# Altium project RFID_CC1101_869MHz.PrjPcb
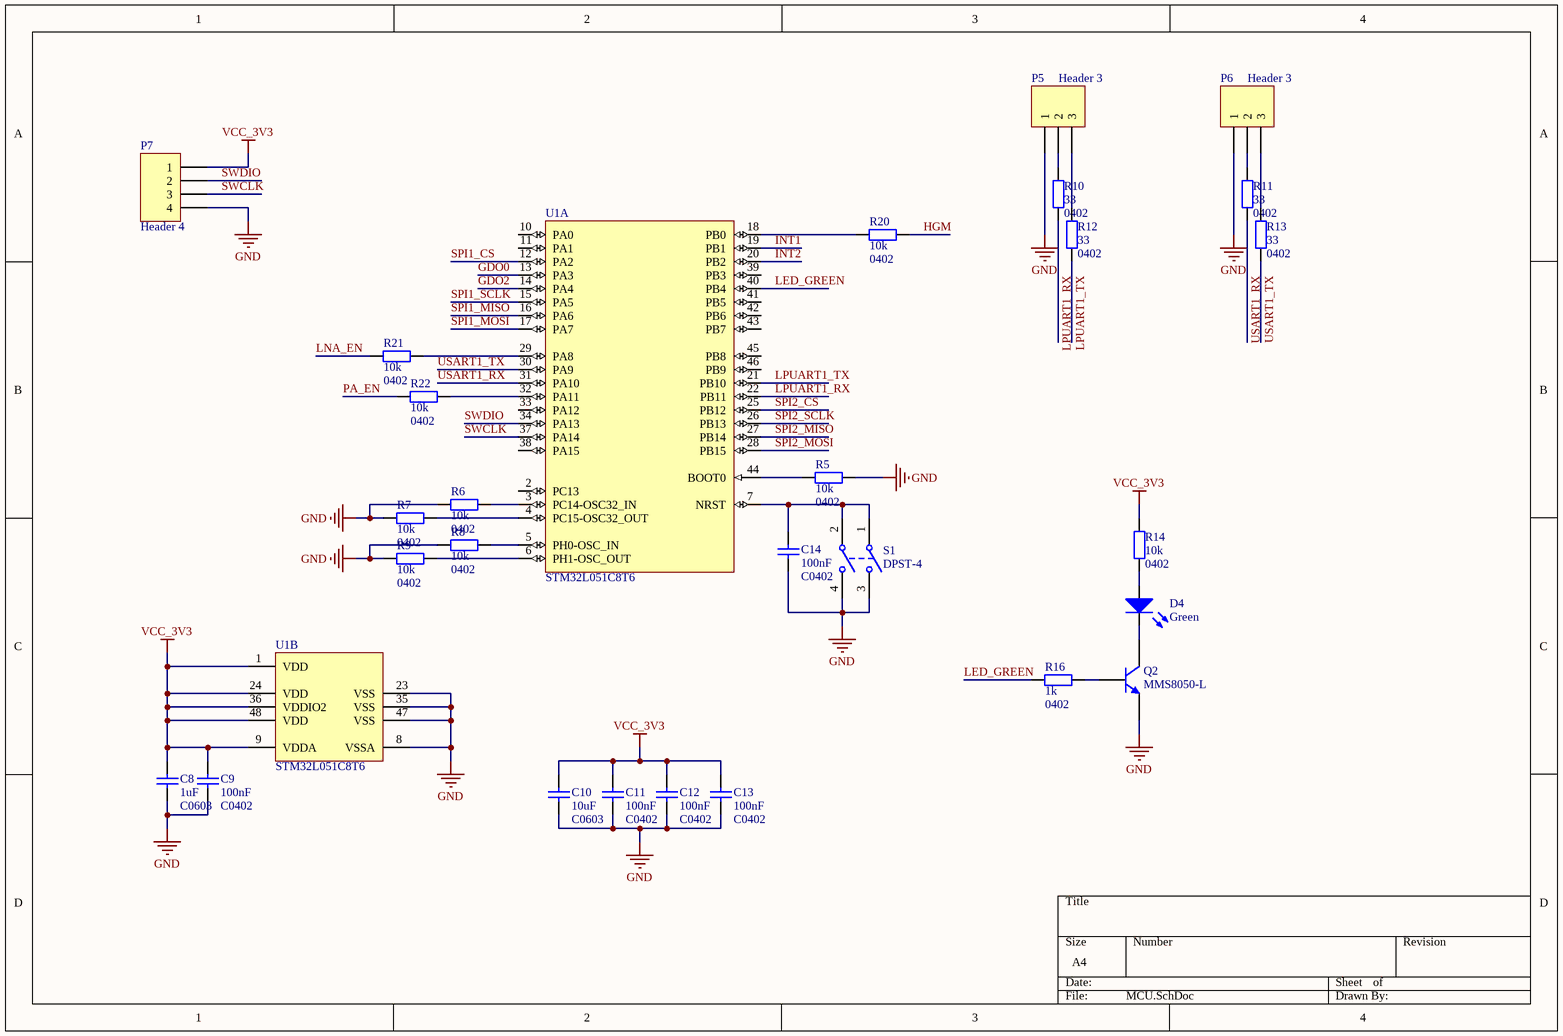
[diagram p0: MCU.SchDoc]
3 sheets, 110 parts. Net scope: global (net labels, ports and power ports of the same name join across sheets).
Board file: RFID_CC1101_869MHz.PcbDoc
Sheets:
  MCU.SchDoc
  Power.SchDoc
  MEMS&RF.SchDoc

## Sheet MCU.SchDoc
size A4

### Parts
C8  1uF  PackageReference: C0603  [1608[0603]]
C9  100nF  PackageReference: C0402  [0402]
C10  10uF  PackageReference: C0603  [1608[0603]]
C11  100nF  PackageReference: C0402  [0402]
C12  100nF  PackageReference: C0402  [0402]
C13  100nF  PackageReference: C0402  [0402]
C14  100nF  PackageReference: C0402  [0402]
D4  Green  [0603/K]
P5  Header 3  [HDR1X3]
P6  Header 3  [HDR1X3]
P7  Header 4  [HDR1x4-2MM]
Q2  MMS8050-L  [SOT-23B_N]
R5  10k  PackageReference: 0402  [RESC1005X04N]
R6  10k  PackageReference: 0402  [RESC1005X04N]
R7  10k  PackageReference: 0402  [RESC1005X04N]
R8  10k  PackageReference: 0402  [RESC1005X04N]
R9  10k  PackageReference: 0402  [RESC1005X04N]
R10  33  PackageReference: 0402  [RESC1005X04N]
R11  33  PackageReference: 0402  [RESC1005X04N]
R12  33  PackageReference: 0402  [RESC1005X04N]
R13  33  PackageReference: 0402  [RESC1005X04N]
R14  10k  PackageReference: 0402  [RESC1005X04N]
R16  1k  PackageReference: 0402  [RESC1005X04N]
R20  10k  PackageReference: 0402  [RESC1005X04N]
R21  10k  PackageReference: 0402  [RESC1005X04N]
R22  10k  PackageReference: 0402  [RESC1005X04N]
S1  DPST-4  [DPST]
U1  STM32L051C8T6  [STM-LQFP48_N]  (parts A,B of 2)

### Nets
GND: C8.1 C9.1 C10.1 C11.2 C12.2 C13.2 C14.2 P5.1 P6.1 P7.4 Q2.E R5.2 R6.1 R7.1 R8.1 R9.1 S1.3(NO1) S1.4(NO2) U1.8(VSSA) U1.23(VSS) U1.35(VSS) U1.47(VSS)
VCC_3V3: C8.2 C9.2 C10.2 C11.1 C12.1 C13.1 P7.1 R14.2 U1.1(VDD) U1.9(VDDA) U1.24(VDD) U1.36(VDDIO2) U1.48(VDD)
GDO0: U1.13(PA3)
GDO2: U1.14(PA4)
HGM: R20.2
INT1: U1.19(PB1)
INT2: U1.20(PB2)
LED_GREEN: R16.1 U1.40(PB4)
LNA_EN: R21.1
LPUART1_RX: R10.1 U1.22(PB11)
LPUART1_TX: R12.2 U1.21(PB10)
PA_EN: R22.1
SPI1_CS: U1.12(PA2)
SPI1_MISO: U1.16(PA6)
SPI1_MOSI: U1.17(PA7)
SPI1_SCLK: U1.15(PA5)
SPI2_CS: U1.25(PB12)
SPI2_MISO: U1.27(PB14)
SPI2_MOSI: U1.28(PB15)
SPI2_SCLK: U1.26(PB13)
SWCLK: P7.3 U1.37(PA14)
SWDIO: P7.2 U1.34(PA13)
USART1_RX: R11.1 U1.31(PA10)
USART1_TX: R13.2 U1.30(PA9)
NetC14_1: C14.1 S1.1(COMMON1) S1.2(COMMON2) U1.7(NRST)
NetD4_A: D4.A R14.1
NetD4_K: D4.K Q2.C
NetP5_2: P5.2 R10.2
NetP5_3: P5.3 R12.1
NetP6_2: P6.2 R11.2
NetP6_3: P6.3 R13.1
NetQ2_B: Q2.B R16.2
NetR5_1: R5.1 U1.44(BOOT0)
NetR6_2: R6.2 U1.3(PC14-OSC32_IN)
NetR7_2: R7.2 U1.4(PC15-OSC32_OUT)
NetR8_2: R8.2 U1.5(PH0-OSC_IN)
NetR9_2: R9.2 U1.6(PH1-OSC_OUT)
NetR20_1: R20.1 U1.18(PB0)
NetR21_2: R21.2 U1.29(PA8)
NetR22_2: R22.2 U1.32(PA11)

Not connected (* = marked no-connect by the designer): U1 2(PC13) 10(PA0) 11(PA1) 33(PA12) 38(PA15) 39(PB3) 41(PB5) 42(PB6) 43(PB7) 45(PB8) 46(PB9)

### Library data of the parts
C8 = CGA3E2X5R1A105K080AA: Capacitor (0603,X5R,1uF,DC 10V,+/-10%) TDK; Published: 8-Jun-2000; LatestRevisionDate: 29-May-2009; LatestRevisionNote: IPC-7351 Footprint Added.; Publisher: Altium Limited; PackageDescription: Chip Capacitor; Value: 1uF
C9 C11-C14 = CGA2B2X5R1A104K050BA: Capacitor (0402,X5R,100nF,DC 10V,±10%) TDK; Published: 8-Jun-2000; LatestRevisionDate: 29-May-2009; LatestRevisionNote: IPC-7351 Footprint Added.; Publisher: Altium Limited; PackageDescription: Chip Capacitor; Value: 100nF
C10 = C1608X5R1A106K080AC: Capacitor (0603,X5R,10uF,DC 10V,±10%) TDK; Published: 8-Jun-2000; LatestRevisionDate: 29-May-2009; LatestRevisionNote: IPC-7351 Footprint Added.; Publisher: Altium Limited; PackageDescription: Chip Capacitor; Value: 10uF
D4 = TLMG1100-GS08: Standard 0603 SMD LED, Green, 2.1V,-40 °C to +100 °C; Published: 8-Jun-2000; LatestRevisionDate: 17-Jul-2002; LatestRevisionNote: Re-released for DXP Platform.; PackageVersion: Feb-2002; PackageReference: 0603; Publisher: Altium Limited; PackageDescription: SM LED; 2 Flat Leads; Valid: Green
P5 P6 = Header 3: Header, 3-Pin; LatestRevisionDate: 17-Jul-2002; LatestRevisionNote: Re-released for DXP Platform.; Publisher: Altium Limited
P7 = Header 4: Header, 4-Pin; LatestRevisionDate: 17-Jul-2002; LatestRevisionNote: Re-released for DXP Platform.; Publisher: Altium Limited
Q2 = MMS8050-L: NPN Silicon  Plastic-Encapsulate  Transistor , MCC , Range:120-200; Published: 8-Jun-2000; LatestRevisionDate: 17-Jul-2002; LatestRevisionNote: Re-released for DXP Platform.; PackageReference: TO-226-AA; Publisher: Altium Limited; PackageDescription: TO, Flat Index; 3 In-Line, Axial Leads; Body Dia. 4.8mm; Leads 0.55 x 0.51 mm (max); Code_JEDEC: TO-226-AA
R5-R9 R14 R20-R22 = RC0402FR-0710KL: Resistor 0402(1005) 10kΩ ±1%; PackageDescription: Chip Resistor, 2-Leads, Body 1.00x0.50mm, IPC Medium Density; Value: 10k
R10-R13 = RC0402FR-0733RL: Resistor 0402(1005) 33Ω ±1%; PackageDescription: Chip Resistor, 2-Leads, Body 1.00x0.50mm, IPC Medium Density; Value: 33
R16 = RC0402FR-071KL: Resistor 0402(1005) 1kΩ ±1%; PackageDescription: Chip Resistor, 2-Leads, Body 1.00x0.50mm, IPC Medium Density; Value: 1k
S1 = CX-G001: 5.2*5.2轻触开关; Published: 24-Mar-1999; LatestRevisionDate: 17-Jul-2002; LatestRevisionNote: Re-released for DXP Platform.; PackageReference: DPST-4; Publisher: Altium Limited; PackageDescription: Switch; 4 Leads
U1 = STM32L051C8T6: Access line ultra-low-power 32-bit MCU Arm®-based Cortex®-M0+, 64 KB Flash, 8 KB SRAM,2 KB EEPROM, 38 fast I/Os, 48-pin LQFP, -40 to 125 degC, Tray; A/D Converter: 2x12-bit; Core: ARM Cortex-M0+; FLASH Size (Prog) (kB): 64; I/Os (High Current): 37; Internal RAM Size (kB): 20; Operating Frequency(F) (Processor speed) (MHz): 32; Supply Voltage(Vcc) min (V): 2; DatasheetVersion: Rev. 16; PackageVersion: Rev. 6, 06/2013; PackageReference: LQFP48; PackageDescription: 48-Pin Low Profile Quad Flat Package, 7 x 7 mm Body, 0.5 mm Pitch; Supplier 1: Digi-Key; Supplier Part Number 1: 497-11517-ND; Supplier 2: Farnell; Supplier Part Number 2: 1899017; Supplier 3: Newark; Supplier Part Number 3: 72T2644; Supplier 4: Mouser; Supplier Part Number 4: 511-STM32L051C8T6; Packing: Tray; Mounting Technology: Surface Mount; PartNumber: STM32L051C8T6; ComponentLink1Description: Manufacturer URL; ComponentLink1URL: http://www.st.com/web/en/home.html; ComponentLink2Description: Datasheet; ComponentLink2URL: http://www.st.com/st-web-ui/static/active/en/resource/technical/document/datasheet/CD00161566.pdf; ComponentLink3Description: Package Specification; ComponentLink3URL: http://www.st.com/st-web-ui/static/active/en/resource/technical/document/datasheet/DM00058181.pdf

## Sheet Power.SchDoc
size A4
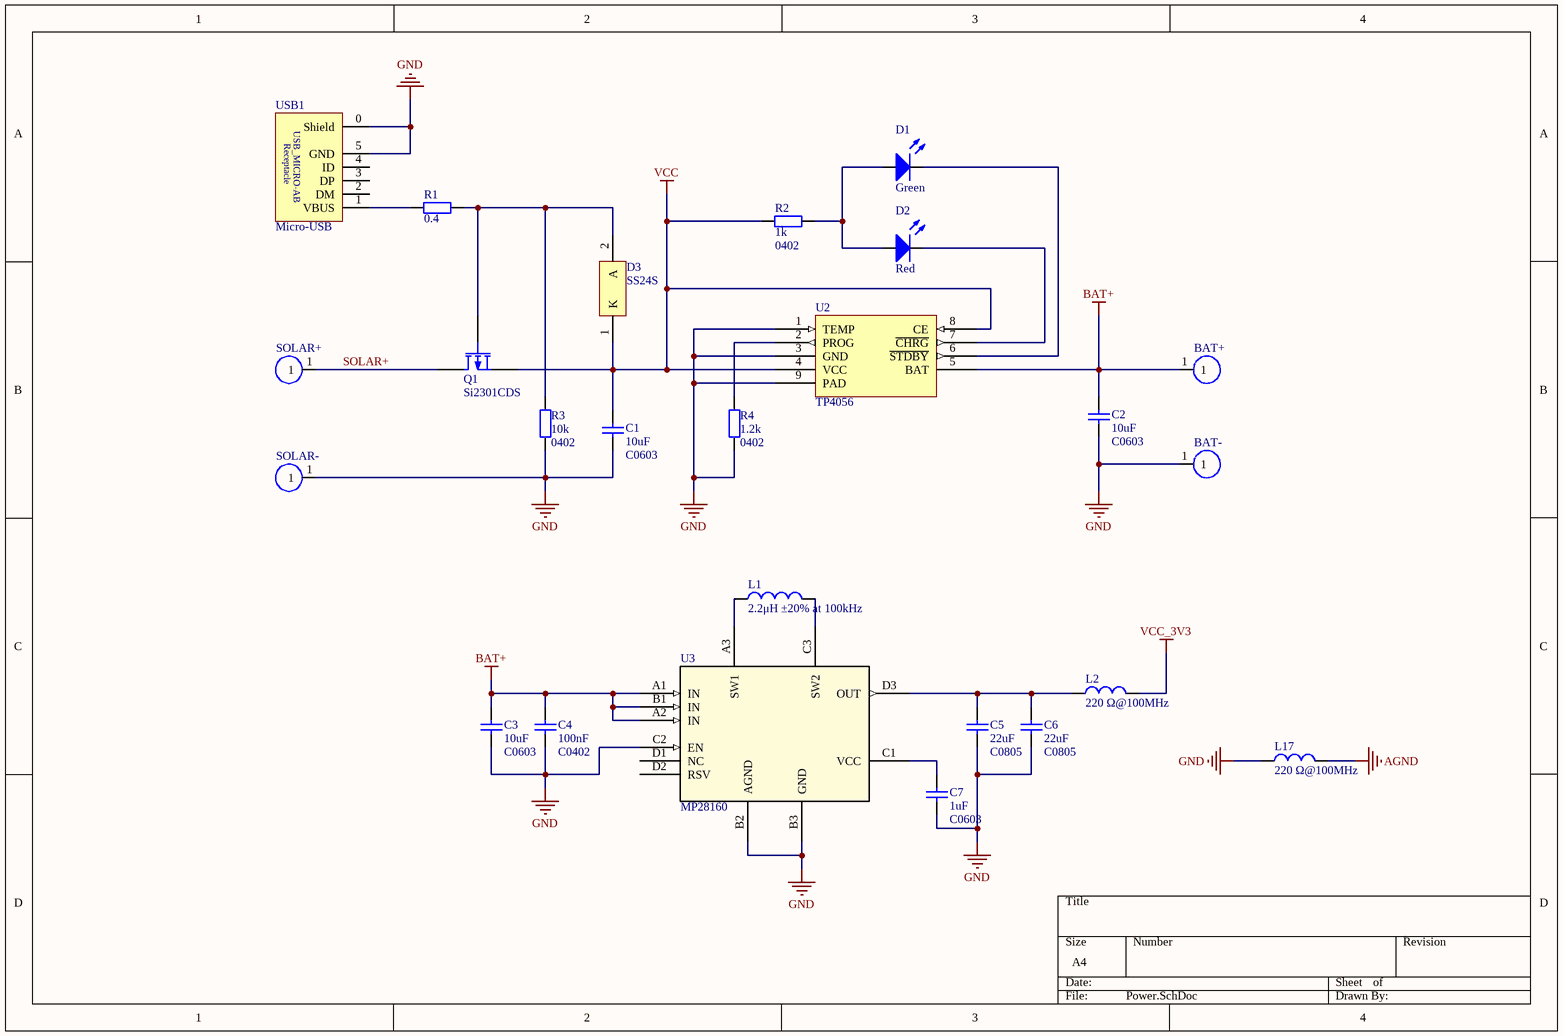
[diagram p1: Power.SchDoc]

### Parts
BAT+  BAT+  [surface_pad]  (value not drawn)
BAT-  BAT-  [surface_pad]  (value not drawn)
C1  10uF  PackageReference: C0603  [1608[0603]]
C2  10uF  PackageReference: C0603  [1608[0603]]
C3  10uF  PackageReference: C0603  [1608[0603]]
C4  100nF  PackageReference: C0402  [0402]
C5  22uF  [C0805]
C6  22uF  [C0805]
C7  1uF  PackageReference: C0603  [1608[0603]]
D1  Green  [0603/K]
D2  Red  [0603/K]
D3  SS24S  [ONSC-SMA-2-403D-02_V]
L1  2.2μH ±20% at 100kHz  [INDP3230X10N]
L2  220 Ω@100MHz  [RESC2012X07N]
L17  220 Ω@100MHz  [RESC2012X07N]
Q1  Si2301CDS  [SOT95P237X112-3N]
R1  0.4  [RESC3216X07N]
R2  1k  PackageReference: 0402  [RESC1005X04N]
R3  10k  PackageReference: 0402  [RESC1005X04N]
R4  1.2k  PackageReference: 0402  [RESC1005X04N]
SOLAR+  SOLAR+  [surface_pad]  (value not drawn)
SOLAR-  SOLAR-  [surface_pad]  (value not drawn)
U2  TP4056  [ESOP-9N]
U3  MP28160  [CSP-12]
USB1  Micro-USB  [USB_Micro_5P4J]

### Nets
AGND: L17.2
BAT+: BAT+.1 C2.2 C3.2 C4.2 U2.5(BAT) U3.A1(IN) U3.A2(IN) U3.B1(IN)
GND: BAT-.1 C1.1 C2.1 C3.1 C4.1 C5.1 C6.1 C7.1 L17.1 R3.1 R4.1 SOLAR-.1 U2.1(TEMP) U2.3(GND) U2.9(PAD) U3.B2(AGND) U3.B3(GND) U3.C2(EN) USB1.0(Shield) USB1.5(GND)
VCC: C1.2 D3.1(K) Q1.2(S) R2.1 U2.4(VCC) U2.8(CE)
VCC_3V3: L2.2
SOLAR+: Q1.3(D) SOLAR+.1
NetC5_2: C5.2 C6.2 L2.1 U3.D3(OUT)
NetC7_2: C7.2 U3.C1(VCC)
NetD1_A: D1.A D2.A R2.2
NetD1_K: D1.K U2.6(~{STDBY})
NetD2_K: D2.K U2.7(~{CHRG})
NetD3_2: D3.2(A) Q1.1(G) R1.2 R3.2
NetL1_1: L1.1 U3.A3(SW1)
NetL1_2: L1.2 U3.C3(SW2)
NetR1_1: R1.1 USB1.1(VBUS)
NetR4_2: R4.2 U2.2(PROG)

Not connected (* = marked no-connect by the designer): U3 D1(NC) D2(RSV); USB1 2(DM) 3(DP) 4(ID)

### Notes on the sheet
- (in symbol USB/Micro-AB) USB_MICRO-AB; Receptacle

### Library data of the parts
BAT+ BAT- SOLAR+ SOLAR- = SURFACE_PAD: PAD
C1-C3 = C1608X5R1A106K080AC: as C10 on sheet MCU; Published: 8-Jun-2000; LatestRevisionDate: 29-May-2009; LatestRevisionNote: IPC-7351 Footprint Added.; Publisher: Altium Limited; PackageDescription: Chip Capacitor; Value: 10uF
C4 = CGA2B2X5R1A104K050BA: as C9 on sheet MCU; Published: 8-Jun-2000; LatestRevisionDate: 29-May-2009; LatestRevisionNote: IPC-7351 Footprint Added.; Publisher: Altium Limited; PackageDescription: Chip Capacitor; Value: 100nF
C5 C6 = C2012X5R1A226K125AB: Capacitor (0805,X5R,22uF,DC 10V,±10%) TDK; Published: 8-Jun-2000; LatestRevisionDate: 29-May-2009; LatestRevisionNote: IPC-7351 Footprint Added.; Publisher: Altium Limited; PackageDescription: Chip Capacitor; Value: 22uF; PackageReference: C0805
C7 = CGA3E2X5R1A105K080AA: as C8 on sheet MCU; Published: 8-Jun-2000; LatestRevisionDate: 29-May-2009; LatestRevisionNote: IPC-7351 Footprint Added.; Publisher: Altium Limited; PackageDescription: Chip Capacitor; Value: 1uF
D1 = TLMG1100-GS08: as D4 on sheet MCU; Published: 8-Jun-2000; LatestRevisionDate: 17-Jul-2002; LatestRevisionNote: Re-released for DXP Platform.; PackageVersion: Feb-2002; PackageReference: 0603; Publisher: Altium Limited; PackageDescription: SM LED; 2 Flat Leads; Valid: Green
D2 = TLMS1100-GS08: Standard 0603 SMD LED, Red, 2.1V,-40 °C to +100 °C; Published: 8-Jun-2000; LatestRevisionDate: 17-Jul-2002; LatestRevisionNote: Re-released for DXP Platform.; PackageVersion: Feb-2002; PackageReference: 0603; Publisher: Altium Limited; PackageDescription: SM LED; 2 Flat Leads; Valid: Red
D3 = SS24S: Schottky Power Rectifier, 2-Pin SMA, VRRM=40V , VF=0.517V at IF=2.0A , Pb-Free, Tape and Reel; Manufacturer: On Semiconductor; Configuration: Single; IFSM Max (A): 40; DatasheetVersion: Rev. 7; PackageVersion: Rev. G, 07/2012; PackageReference: SMA-2-403D-02; PackageDescription: 2-Pin Small Molded Package, J-Bend Lead, Body 2.605 x 4.315 mm; Supplier 1: Digi-Key; Supplier Part Number 1: SS16T3GOSTR-ND; Supplier 2: Digi-Key; Supplier Part Number 2: SS16T3GOSCT-ND; Supplier 3: Digi-Key; Supplier Part Number 3: SS16T3GOSDKR-ND; Supplier 4: Farnell; Supplier Part Number 4: 2317421; Supplier 5: Farnell; Supplier Part Number 5: 1900107; Supplier 6: Newark; Supplier Part Number 6: 98H0976; Supplier 7: Newark; Supplier Part Number 7: 10N9613; Supplier 8: Mouser; Supplier Part Number 8: 863-SS16T3G; Packing: Tape and Reel; RoHS: TRUE; Mounting Technology: Surface Mount; PartNumber: SS24S; ComponentLink1Description: Manufacturer URL; ComponentLink1URL: http://www.onsemi.com/; ComponentLink2Description: Datasheet; ComponentLink2URL: http://www.onsemi.cn/pub_link/Collateral/SS16-D.PDF; ComponentLink3Description: Package Specification; ComponentLink3URL: http://www.onsemi.com/pub_link/Collateral/403D-02.PDF
L1 = SPM3010T-2R2M-LR: inductor_commercial_power, 2.2μH ±20% at 100kHz, 2.6A, 3.2mm*3.0mm, -40～125°C; PackageReference: 3230; PackageDescription: inductor, 2-Leads, Body 2.00x1.25mm, IPC Medium Density; Value: 2.2μH ±20% at 100kHz
L2 L17 = FBMH2012HM221-T: 220Ω, 2 A, 0805/2012 (EIA/JIS); PackageReference: 0805; PackageDescription: Bead Inductor, 2-Leads, Body 2.00x1.25mm, IPC Medium Density; Value: 220 Ω@100MHz
Q1 = Si2301CDS: P-Channel MOSFET,VDS=-20V,VGS=8V,ID=3.1A,VGS(th)Min=0.4V,SOT-23; Published: 8-Jun-2000; LatestRevisionDate: 17-Jul-2002; LatestRevisionNote: Re-released for DXP Platform.; PackageVersion: 1995/1996; PackageReference: SOT23; Publisher: Altium Limited; PackageDescription: SOT23, 3-Leads, Body 2.92x2.37mm, Pitch 0.95mm, IPC Medium Density
R1 = PE1206FRF470R4L: Resistor 1206(3216) 0.4Ω ±1% 1W AUTOMOTIVE GRADEPE_L series; PackageReference: 1206; PackageDescription: Chip Resistor, 2-Leads, Body 3.20x1.60mm, IPC Medium Density; Value: 0.4
R2 = RC0402FR-071KL: Resistor 0402(1005) 1kΩ ±1%; PackageDescription: Chip Resistor, 2-Leads, Body 1.00x0.50mm, IPC Medium Density; Value: 1k
R3 = RC0402FR-0710KL: Resistor 0402(1005) 10kΩ ±1%; PackageDescription: Chip Resistor, 2-Leads, Body 1.00x0.50mm, IPC Medium Density; Value: 10k
R4 = RC0402FR-071K2L: Resistor 0402(1005) 1.2kΩ ±1%; PackageDescription: Chip Resistor, 2-Leads, Body 1.00x0.50mm, IPC Medium Density; Value: 1.2k
U2 = TP4056: 1A线性锂离子电池充电器
U3 = MP28160: 5.5V/0.5A High-EfficiencyIntegrated Buck-Boost Converterwith 3.3V FixedOutput in 1.4x1.8mm CSP Package; Vendor: MPS; Iout: 500mA; Vin: 2.5V to 5.5V; Manufacturer_Part_Number: CSP-12; Vout: 3.3V
USB1 = USB/Micro-AB: Receptacle,Micro 5脚贴片 不带定位柱

## Sheet MEMS&RF.SchDoc
size A4
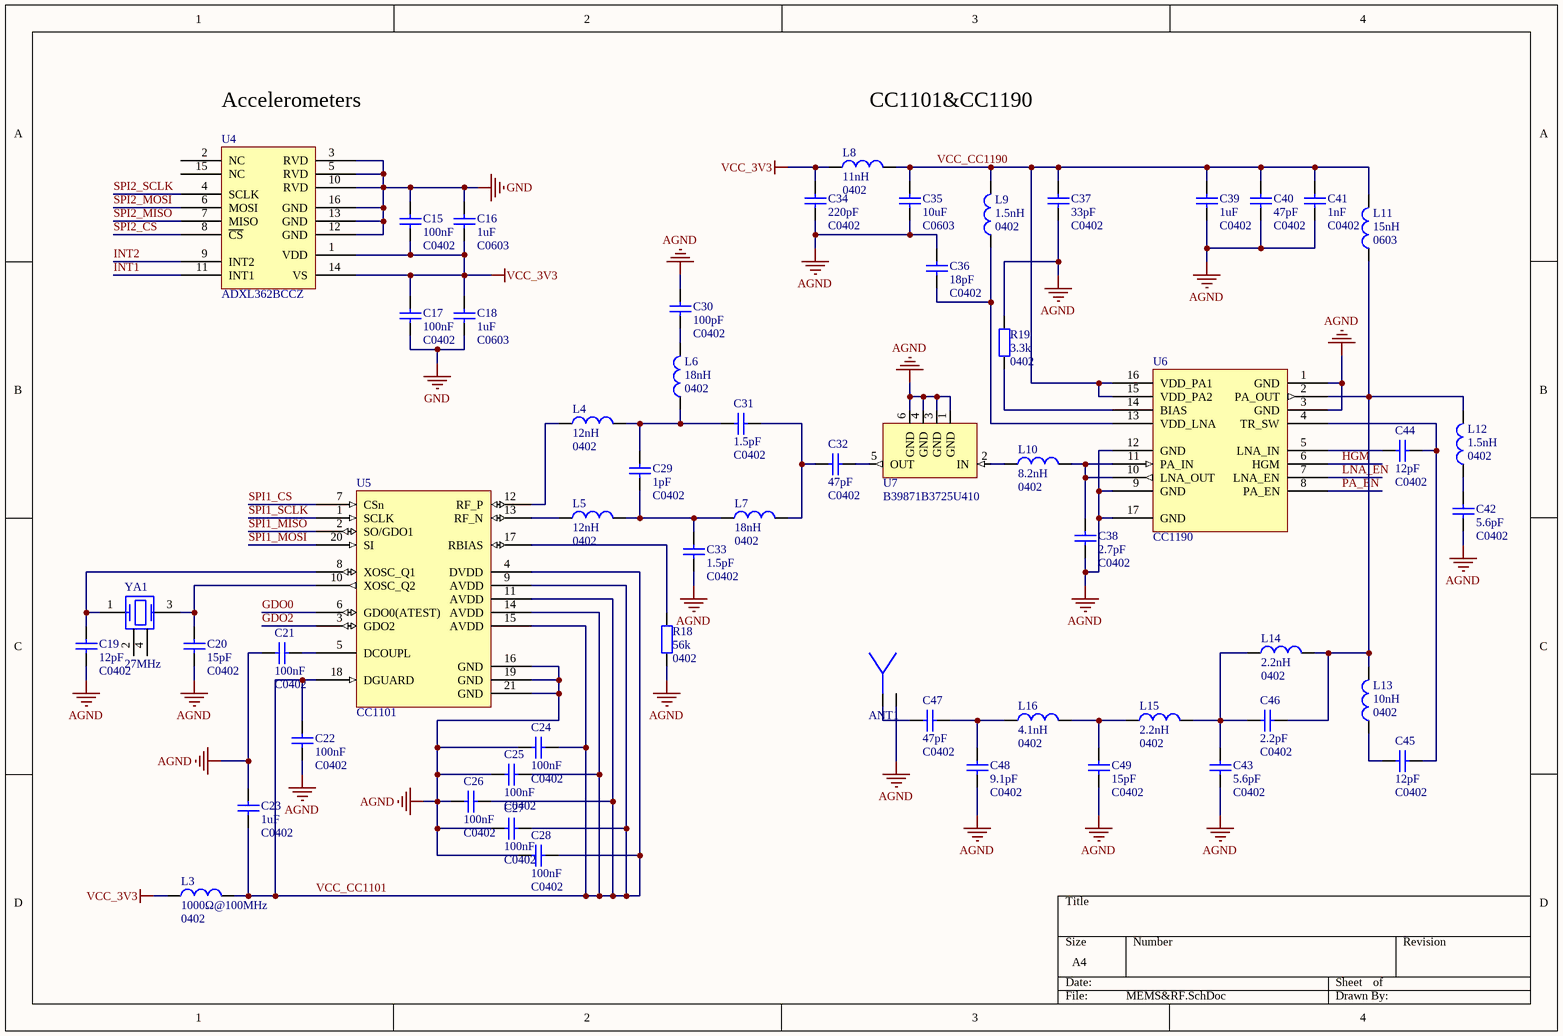
[diagram p2: MEMS&RF.SchDoc]

### Parts
ANT1  ANT  [SMB-xg]  (value not drawn)
C15  100nF  PackageReference: C0402  [0402]
C16  1uF  PackageReference: C0603  [1608[0603]]
C17  100nF  PackageReference: C0402  [0402]
C18  1uF  PackageReference: C0603  [1608[0603]]
C19  12pF  PackageReference: C0402  [0402]
C20  15pF  PackageReference: C0402  [0402]
C21  100nF  PackageReference: C0402  [0402]
C22  100nF  PackageReference: C0402  [0402]
C23  1uF  PackageReference: C0402  [0402]
C24  100nF  PackageReference: C0402  [0402]
C25  100nF  PackageReference: C0402  [0402]
C26  100nF  PackageReference: C0402  [0402]
C27  100nF  PackageReference: C0402  [0402]
C28  100nF  PackageReference: C0402  [0402]
C29  1pF  PackageReference: C0402  [0402]
C30  100pF  PackageReference: C0402  [0402]
C31  1.5pF  PackageReference: C0402  [0402]
C32  47pF  PackageReference: C0402  [0402]
C33  1.5pF  PackageReference: C0402  [0402]
C34  220pF  PackageReference: C0402  [0402]
C35  10uF  PackageReference: C0603  [1608[0603]]
C36  18pF  PackageReference: C0402  [0402]
C37  33pF  PackageReference: C0402  [0402]
C38  2.7pF  PackageReference: C0402  [0402]
C39  1uF  PackageReference: C0402  [0402]
C40  47pF  PackageReference: C0402  [0402]
C41  1nF  PackageReference: C0402  [0402]
C42  5.6pF  PackageReference: C0402  [0402]
C43  5.6pF  PackageReference: C0402  [0402]
C44  12pF  PackageReference: C0402  [0402]
C45  12pF  PackageReference: C0402  [0402]
C46  2.2pF  PackageReference: C0402  [0402]
C47  47pF  PackageReference: C0402  [0402]
C48  9.1pF  PackageReference: C0402  [0402]
C49  15pF  PackageReference: C0402  [0402]
L3  1000Ω@100MHz  [0402]
L4  12nH  [0402]
L5  12nH  [0402]
L6  18nH  [0402]
L7  18nH  [0402]
L8  11nH  [0402]
L9  1.5nH  [0402]
L10  8.2nH  [0402]
L11  15nH  PackageReference: 0603  [1608[0603]]
L12  1.5nH  [0402]
L13  10nH  [0402]
L14  2.2nH  [0402]
L15  2.2nH  [0402]
L16  4.1nH  [0402]
R18  56k  PackageReference: 0402  [RESC1005X04N]
R19  3.3k  PackageReference: 0402  [RESC1005X04N]
U4  ADXL362BCCZ  [LGA_CC-16-4]
U5  CC1101  [QFN50P400X400X100_HS-21N]
U6  CC1190  [QFN65P400X400X100_HS-17N]
U7  B39871B3725U410  [DCC6C]
YA1  27MHz  [XTAL-SMT-4P]

### Nets
AGND: ANT1.2(GND) C19.1 C20.1 C21.1 C22.1 C23.2 C24.2 C25.2 C26.2 C27.2 C28.2 C30.2 C33.1 C34.1 C35.1 C36.2 C37.1 C38.1 C39.1 C40.1 C41.1 C42.1 C43.1 C48.1 C49.1 R18.1 R19.2 U5.16(GND) U5.19(GND) U5.21(GND) U6.1(GND) U6.3(GND) U6.9(GND) U6.12(GND) U6.17(GND) U7.1(GND) U7.3(GND) U7.4(GND) U7.6(GND)
GND: C15.1 C16.2 C17.2 C18.1 U4.3(RVD) U4.5(RVD) U4.10(RVD) U4.12(GND) U4.13(GND) U4.16(GND)
VCC_3V3: C15.2 C16.1 C17.1 C18.2 C34.2 L3.1 L8.1 U4.1(VDD) U4.14(VS)
GDO0: U5.6(GDO0(ATEST))
GDO2: U5.3(GDO2)
HGM: U6.6(HGM)
INT1: U4.11(INT1)
INT2: U4.9(INT2)
LNA_EN: U6.7(LNA_EN)
PA_EN: U6.8(PA_EN)
SPI1_CS: U5.7(CSn)
SPI1_MISO: U5.2(SO/GDO1)
SPI1_MOSI: U5.20(SI)
SPI1_SCLK: U5.1(SCLK)
SPI2_CS: U4.8(~{CS})
SPI2_MISO: U4.7(MISO)
SPI2_MOSI: U4.6(MOSI)
SPI2_SCLK: U4.4(SCLK)
VCC_CC1101: C22.2 C23.1 C24.1 C25.1 C26.1 C27.1 C28.1 L3.2 U5.4(DVDD) U5.9(AVDD) U5.11(AVDD) U5.14(AVDD) U5.15(AVDD) U5.18(DGUARD)
VCC_CC1190: C35.2 C37.2 C39.2 C40.2 C41.2 L8.2 L9.2 L11.2 U6.15(VDD_PA2) U6.16(VDD_PA1)
NetANT1_1: ANT1.1(Antenna) C47.1
NetC19_2: C19.2 U5.8(XOSC_Q1) YA1.1
NetC20_2: C20.2 U5.10(XOSC_Q2) YA1.3
NetC21_2: C21.2 U5.5(DCOUPL)
NetC29_1: C29.1 C33.2 L5.2 L7.1
NetC29_2: C29.2 C31.1 L4.2 L6.1
NetC30_1: C30.1 L6.2
NetC31_2: C31.2 C32.1 L7.2
NetC32_2: C32.2 U7.5(OUT)
NetC36_1: C36.1 L9.1 U6.13(VDD_LNA)
NetC38_2: C38.2 L10.2 U6.10(LNA_OUT) U6.11(PA_IN)
NetC42_2: C42.2 L12.1
NetC43_2: C43.2 C46.1 L14.1 L15.2
NetC44_1: C44.1 U6.5(LNA_IN)
NetC44_2: C44.2 C45.2 U6.4(TR_SW)
NetC45_1: C45.1 L13.1
NetC46_2: C46.2 L11.1 L12.2 L13.2 L14.2 U6.2(PA_OUT)
NetC47_2: C47.2 C48.2 L16.1
NetC49_2: C49.2 L15.1 L16.2
NetL4_1: L4.1 U5.12(RF_P)
NetL5_1: L5.1 U5.13(RF_N)
NetL10_1: L10.1 U7.2(IN)
NetR18_2: R18.2 U5.17(RBIAS)
NetR19_1: R19.1 U6.14(BIAS)

Not connected (* = marked no-connect by the designer): U4 2(NC) 15(NC); YA1 2 4

### Notes on the sheet
- (near U4) Accelerometers
- CC1101&CC1190

### Library data of the parts
ANT1 = ANT: Antenna,GPS_ANT_IPX
C15 C17 = C1005X7R1H104K050BE: Capacitor (0402,X7R,100nF,DC 50V,±10%) TDK; Published: 8-Jun-2000; LatestRevisionDate: 29-May-2009; LatestRevisionNote: IPC-7351 Footprint Added.; Publisher: Altium Limited; PackageDescription: Chip Capacitor; Value: 100nF
C16 C18 = CGA3E2X5R1A105K080AA: as C8 on sheet MCU; Published: 8-Jun-2000; LatestRevisionDate: 29-May-2009; LatestRevisionNote: IPC-7351 Footprint Added.; Publisher: Altium Limited; PackageDescription: Chip Capacitor; Value: 1uF
C19 C44 C45 = GRM1555C1H120JZ01D: Capacitor (0402,NP0,12pF,DC 50V,±5%) Murata; Published: 8-Jun-2000; LatestRevisionDate: 29-May-2009; LatestRevisionNote: IPC-7351 Footprint Added.; Publisher: Altium Limited; PackageDescription: Chip Capacitor; Value: 12pF
C20 C49 = GRM1555C1H150JZ01D: Capacitor (0402,NP0,15pF,DC 50V,±5%) Murata; Published: 8-Jun-2000; LatestRevisionDate: 29-May-2009; LatestRevisionNote: IPC-7351 Footprint Added.; Publisher: Altium Limited; PackageDescription: Chip Capacitor; Value: 15pF
C21 C22 C24-C28 = GRM155R71A104KA01D: Capacitor (0402,X5R,100nF,DC 10V,±10%) Murata; Published: 8-Jun-2000; LatestRevisionDate: 29-May-2009; LatestRevisionNote: IPC-7351 Footprint Added.; Publisher: Altium Limited; PackageDescription: Chip Capacitor; Value: 100nF
C23 C39 = GRM155R60J105KE19D: Capacitor (0402,X5R,1uF,DC 6.3V,±10%) Murata; Published: 8-Jun-2000; LatestRevisionDate: 29-May-2009; LatestRevisionNote: IPC-7351 Footprint Added.; Publisher: Altium Limited; PackageDescription: Chip Capacitor; Value: 1uF
C29 = GRM1555C1H1R0CZ01D: Capacitor (0402,NP0,1pF,DC 50V,±0.25pF) Murata; Published: 8-Jun-2000; LatestRevisionDate: 29-May-2009; LatestRevisionNote: IPC-7351 Footprint Added.; Publisher: Altium Limited; PackageDescription: Chip Capacitor; Value: 1pF
C30 = GRM1555C1H101JZ01D: Capacitor (0402,NP0,100pF,DC 50V,±5%) Murata; Published: 8-Jun-2000; LatestRevisionDate: 29-May-2009; LatestRevisionNote: IPC-7351 Footprint Added.; Publisher: Altium Limited; PackageDescription: Chip Capacitor; Value: 100pF
C31 C33 = GRM1555C1H1R5CZ01D: Capacitor (0402,NP0,1.5pF,DC 50V,±0.25pF) Murata; Published: 8-Jun-2000; LatestRevisionDate: 29-May-2009; LatestRevisionNote: IPC-7351 Footprint Added.; Publisher: Altium Limited; PackageDescription: Chip Capacitor; Value: 1.5pF
C32 C40 C47 = GRM1555C1H470JZ01D: Capacitor (0402,NP0,47pF,DC 50V,±5%) Murata; Published: 8-Jun-2000; LatestRevisionDate: 29-May-2009; LatestRevisionNote: IPC-7351 Footprint Added.; Publisher: Altium Limited; PackageDescription: Chip Capacitor; Value: 47pF
C34 = GRM1555C1H221JA01D: Capacitor (0402,NP0,220pF,DC 50V,±5%) Murata; Published: 8-Jun-2000; LatestRevisionDate: 29-May-2009; LatestRevisionNote: IPC-7351 Footprint Added.; Publisher: Altium Limited; PackageDescription: Chip Capacitor; Value: 220pF
C35 = GRM188R60G106ME47D: Capacitor (0603,X5R,10uF,DC 4V,+/-20%) Murata; Published: 8-Jun-2000; LatestRevisionDate: 29-May-2009; LatestRevisionNote: IPC-7351 Footprint Added.; Publisher: Altium Limited; PackageDescription: Chip Capacitor; Value: 10uF
C36 = GRM1555C1H180JZ01D: Capacitor (0402,NP0,18pF,DC 25V,±5%) Murata; Published: 8-Jun-2000; LatestRevisionDate: 29-May-2009; LatestRevisionNote: IPC-7351 Footprint Added.; Publisher: Altium Limited; PackageDescription: Chip Capacitor; Value: 18pF
C37 = GRM1555C1H330JZ01D: Capacitor (0402,NP0,33pF,DC 50V,±5%) Murata; Published: 8-Jun-2000; LatestRevisionDate: 29-May-2009; LatestRevisionNote: IPC-7351 Footprint Added.; Publisher: Altium Limited; PackageDescription: Chip Capacitor; Value: 33pF
C38 = GRM1555C1H2R7CZ01D: Capacitor (0402,NP0,2.7pF,DC 50V,±0.25pF) Murata; Published: 8-Jun-2000; LatestRevisionDate: 29-May-2009; LatestRevisionNote: IPC-7351 Footprint Added.; Publisher: Altium Limited; PackageDescription: Chip Capacitor; Value: 2.7pF
C41 = GRM1555C1H102JA01D: Capacitor (0402,NP0,1nF,DC 50V,±5%) Murata; Published: 8-Jun-2000; LatestRevisionDate: 29-May-2009; LatestRevisionNote: IPC-7351 Footprint Added.; Publisher: Altium Limited; PackageDescription: Chip Capacitor; Value: 1nF
C42 C43 = GRM1555C1H5R6CZ01D: Capacitor (0402,NP0,5.6pF,DC 50V,±0.25pF) Murata; Published: 8-Jun-2000; LatestRevisionDate: 29-May-2009; LatestRevisionNote: IPC-7351 Footprint Added.; Publisher: Altium Limited; PackageDescription: Chip Capacitor; Value: 5.6pF
C46 = GRM1555C1H2R2CZ01: Capacitor (0402,NP0,2.2pF,DC 50V,±0.25pF) Murata; Published: 8-Jun-2000; LatestRevisionDate: 29-May-2009; LatestRevisionNote: IPC-7351 Footprint Added.; Publisher: Altium Limited; PackageDescription: Chip Capacitor; Value: 2.2pF
C48 = GRM1555C1H9R1CA01D: Capacitor (0402,NP0,9.1pF,DC 50V,±0.25pF) Murata; Published: 8-Jun-2000; LatestRevisionDate: 29-May-2009; LatestRevisionNote: IPC-7351 Footprint Added.; Publisher: Altium Limited; PackageDescription: Chip Capacitor; Value: 9.1pF
L3 = BLM15HG102SN1D: Inductor,EMI filter bead, 1000Ω@100MHz 250mA, 0402 1k ohms Tape GHz Band Gen Use, Murata; Published: 8-Jun-2000; LatestRevisionDate: 29-May-2009; LatestRevisionNote: IPC-7351 Footprint Added.; Publisher: Altium Limited; PackageDescription: Inductor; Value: 1000Ω@100MHz; PackageReference: 0402
L4 L5 = LQW15AN12NJ00D: Inductor, 12n, 0402, ±5%, wire-wound type Murata; Published: 8-Jun-2000; LatestRevisionDate: 29-May-2009; LatestRevisionNote: IPC-7351 Footprint Added.; Publisher: Altium Limited; PackageDescription: Inductor; Value: 12nH; PackageReference: 0402
L6 L7 = LQW15AN18NJ00D: Inductor, 18n, 0402, ±5%, wire-wound type Murata; Published: 8-Jun-2000; LatestRevisionDate: 29-May-2009; LatestRevisionNote: IPC-7351 Footprint Added.; Publisher: Altium Limited; PackageDescription: Inductor; Value: 18nH; PackageReference: 0402
L8 = LQW15AN11NJ00: Inductor, 11n, 0402, ±5%, wire-wound type Murata; Published: 8-Jun-2000; LatestRevisionDate: 29-May-2009; LatestRevisionNote: IPC-7351 Footprint Added.; Publisher: Altium Limited; PackageDescription: Inductor; Value: 11nH; PackageReference: 0402
L9 L12 = LQG15HS1N5S02D: Inductor, 1n5, 0402, Monolithic type, +/-0.3 nH Murata; Published: 8-Jun-2000; LatestRevisionDate: 29-May-2009; LatestRevisionNote: IPC-7351 Footprint Added.; Publisher: Altium Limited; PackageDescription: Inductor; Value: 1.5nH; PackageReference: 0402
L10 = LQG15HS8N2J02D: Inductor, 8n2, 0402, ±5% / Murata; Published: 8-Jun-2000; LatestRevisionDate: 29-May-2009; LatestRevisionNote: IPC-7351 Footprint Added.; Publisher: Altium Limited; PackageDescription: Inductor; Value: 8.2nH; PackageReference: 0402
L11 = LQW18AN15NJ00: Inductor, 15n, 0603, ±5%, wire-wound type Murata; Published: 8-Jun-2000; LatestRevisionDate: 29-May-2009; LatestRevisionNote: IPC-7351 Footprint Added.; Publisher: Altium Limited; PackageDescription: Inductor; Value: 15nH
L13 = LQW15AN10NJ00D: Inductor, 10n, 0402, ±5%, wire-wound type Murata; Published: 8-Jun-2000; LatestRevisionDate: 29-May-2009; LatestRevisionNote: IPC-7351 Footprint Added.; Publisher: Altium Limited; PackageDescription: Inductor; Value: 10nH; PackageReference: 0402
L14 L15 = LQW15AN2N2C10D: Inductor, 2n2, 0402, wire-wound type, +/- 0.2 nH Murata; Published: 8-Jun-2000; LatestRevisionDate: 29-May-2009; LatestRevisionNote: IPC-7351 Footprint Added.; Publisher: Altium Limited; PackageDescription: Inductor; Value: 2.2nH; PackageReference: 0402
L16 = LQW15AN4N1C00: Inductor, 4n1, 0402, +/-0.2nH, wire-wound type Murata; Published: 8-Jun-2000; LatestRevisionDate: 29-May-2009; LatestRevisionNote: IPC-7351 Footprint Added.; Publisher: Altium Limited; PackageDescription: Inductor; Value: 4.1nH; PackageReference: 0402
R18 = RK73H1ETTP5602F: Resistor, 56k ohms, 0402, ±1% Koa; PackageDescription: Chip Resistor, 2-Leads, Body 1.00x0.50mm, IPC Medium Density; Value: 56k
R19 = RK73H1ETTP3301F: Resistor, 3.3k ohms, 0402, ±1% Koa; PackageDescription: Chip Resistor, 2-Leads, Body 1.00x0.50mm, IPC Medium Density; Value: 3.3k
U4 = ADXL362BCCZ: ADXL362, LGA, CC-16-4.
U5 = CC1101: Low-Power Sub-1GHz RF Transceiver
U6 = CC1190: 850– 950MHzRFFrontEnd
U7 = B39871B3725U410: SAW RF filter,Low-loss RF filter for remote control receivers,Center frequency 69 MHz,Usable pass band 2MHz
YA1 = NX3225GA: Crystal, 27.000000MHz, 10.0pF, 50 ohms max, NDK; Valid: 27MHz

## Nets that join several sheets
AGND: Power (L17.2), MEMS&RF (39 pins)
GND: MCU (22 pins), Power (20 pins), MEMS&RF (10 pins)
VCC_3V3: MCU (13 pins), Power (L2.2), MEMS&RF (9 pins)
GDO0: MCU (U1.13), MEMS&RF (U5.6)
GDO2: MCU (U1.14), MEMS&RF (U5.3)
HGM: MCU (R20.2), MEMS&RF (U6.6)
INT1: MCU (U1.19), MEMS&RF (U4.11)
INT2: MCU (U1.20), MEMS&RF (U4.9)
LNA_EN: MCU (R21.1), MEMS&RF (U6.7)
PA_EN: MCU (R22.1), MEMS&RF (U6.8)
SPI1_CS: MCU (U1.12), MEMS&RF (U5.7)
SPI1_MISO: MCU (U1.16), MEMS&RF (U5.2)
SPI1_MOSI: MCU (U1.17), MEMS&RF (U5.20)
SPI1_SCLK: MCU (U1.15), MEMS&RF (U5.1)
SPI2_CS: MCU (U1.25), MEMS&RF (U4.8)
SPI2_MISO: MCU (U1.27), MEMS&RF (U4.7)
SPI2_MOSI: MCU (U1.28), MEMS&RF (U4.6)
SPI2_SCLK: MCU (U1.26), MEMS&RF (U4.4)